# Altium schematic sheet TestPoints.SchDoc
size A
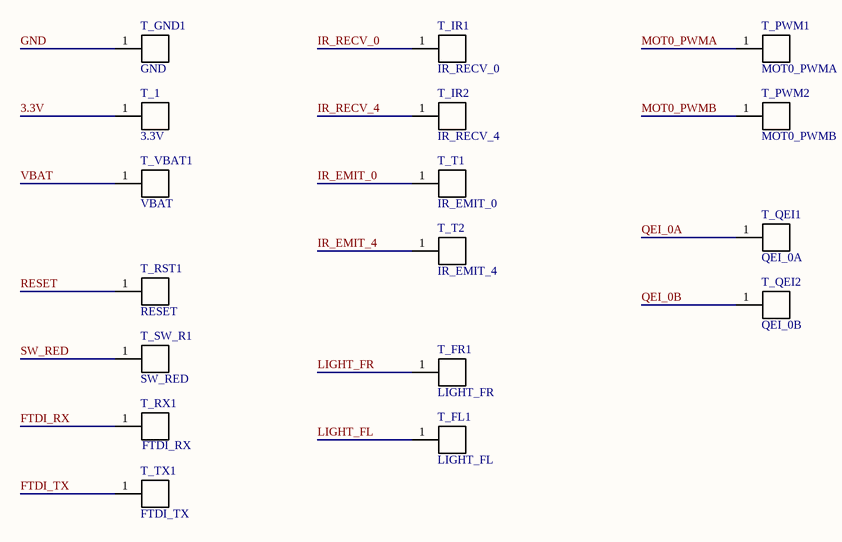
[diagram p0: TestPoints.SchDoc]

## Parts
T_1  3.3V  [TestPoint]
T_FL1  LIGHT_FL  [TestPoint]
T_FR1  LIGHT_FR  [TestPoint]
T_GND1  GND  [TestPoint]
T_IR1  IR_RECV_0  [TestPoint]
T_IR2  IR_RECV_4  [TestPoint]
T_PWM1  MOT0_PWMA  [TestPoint]
T_PWM2  MOT0_PWMB  [TestPoint]
T_QEI1  QEI_0A  [TestPoint]
T_QEI2  QEI_0B  [TestPoint]
T_RST1  RESET  [TestPoint]
T_RX1  FTDI_RX  [TestPoint]
T_SW_R1  SW_RED  [TestPoint]
T_T1  IR_EMIT_0  [TestPoint]
T_T2  IR_EMIT_4  [TestPoint]
T_TX1  FTDI_TX  [TestPoint]
T_VBAT1  VBAT  [TestPoint]

## Nets
3.3V: T_1.1
FTDI_RX: T_RX1.1
FTDI_TX: T_TX1.1
GND: T_GND1.1
IR_EMIT_0: T_T1.1
IR_EMIT_4: T_T2.1
IR_RECV_0: T_IR1.1
IR_RECV_4: T_IR2.1
LIGHT_FL: T_FL1.1
LIGHT_FR: T_FR1.1
MOT0_PWMA: T_PWM1.1
MOT0_PWMB: T_PWM2.1
QEI_0A: T_QEI1.1
QEI_0B: T_QEI2.1
RESET: T_RST1.1
SW_RED: T_SW_R1.1
VBAT: T_VBAT1.1

## Library data of the parts
T_1 T_FL1 T_FR1 T_GND1 T_IR1 T_IR2 T_PWM1 T_PWM2 T_QEI1 T_QEI2 T_RST1 T_RX1 T_SW_R1 T_T1 T_T2 T_TX1 T_VBAT1 = TestPoint